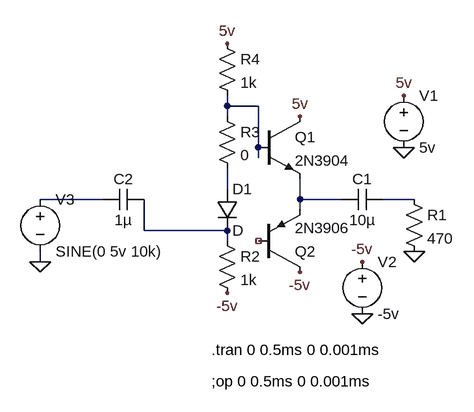
[diagram p0: schematic Az5.asc]
Az5.asc, the LTspice schematic file:
Version 4
SHEET 1 880 680
WIRE 16 -96 16 -112
WIRE 64 -96 16 -96
WIRE 16 -80 16 -96
WIRE 64 -32 64 -96
WIRE 64 -16 64 -32
WIRE 16 32 16 0
WIRE -176 48 -272 48
WIRE 128 48 128 16
WIRE 192 48 128 48
WIRE 304 48 256 48
WIRE 128 64 128 48
WIRE -112 96 -112 48
WIRE 16 96 -112 96
WIRE 16 112 16 96
WIRE -272 144 -272 128
FLAG -272 144 0
FLAG 224 224 0
FLAG 288 -32 0
FLAG 304 128 0
FLAG 288 -112 5v
FLAG 128 -80 5v
FLAG 224 144 -5v
FLAG 128 160 -5v
FLAG 16 192 -5v
FLAG 16 -192 5v
SYMBOL npn 64 -80 R0
SYMATTR InstName Q1
SYMATTR Value 2N3904
SYMBOL pnp 64 160 M180
SYMATTR InstName Q2
SYMATTR Value 2N3906
SYMBOL res 288 32 R0
SYMATTR InstName R1
SYMATTR Value 470
SYMBOL cap 256 32 R90
WINDOW 0 0 32 VBottom 2
WINDOW 3 32 32 VTop 2
SYMATTR InstName C1
SYMATTR Value 10µ
SYMBOL voltage 288 -128 R0
WINDOW 123 0 0 Left 0
WINDOW 39 0 0 Left 0
SYMATTR InstName V1
SYMATTR Value 5v
SYMBOL voltage 224 128 R0
SYMATTR InstName V2
SYMATTR Value -5v
SYMBOL voltage -272 32 R0
WINDOW 123 0 0 Left 0
WINDOW 39 0 0 Left 0
SYMATTR InstName V3
SYMATTR Value SINE(0 5v 10k)
SYMBOL res 0 96 R0
SYMATTR InstName R2
SYMATTR Value 1k
SYMBOL res 0 -208 R0
SYMATTR InstName R4
SYMATTR Value 1k
SYMBOL res 0 -96 R0
SYMATTR InstName R3
SYMATTR Value 0
SYMBOL diode 0 32 R0
SYMATTR InstName D1
SYMBOL cap -112 32 R90
WINDOW 0 0 32 VBottom 2
WINDOW 3 32 32 VTop 2
SYMATTR InstName C2
SYMATTR Value 1µ
TEXT -8 280 Left 2 !.tran 0 0.5ms 0 0.001ms
TEXT -8 328 Left 2 !;op 0 0.5ms 0 0.001ms

The netlist it stands for:
* Az5.asc
Q1 5v N001 N004 0 2N3904
Q2 -5v NC_01 N004 0 2N3906
R1 N005 0 470
C1 N005 N004 10µ
V1 5v 0 5v
V2 -5v 0 -5v
V3 N003 0 SINE(0 5v 10k)
R2 N006 -5v 1k
R4 5v N001 1k
R3 N001 N002 0
D1 N002 N006 D
C2 N006 N003 1µ
.model D D
.lib standard.dio
.model NPN NPN
.model PNP PNP
.lib standard.bjt
.tran 0 0.5ms 0 0.001ms
;op 0 0.5ms 0 0.001ms
.backanno
.end